# Altium schematic sheet Main Board.SchDoc: Main Board
size Letter
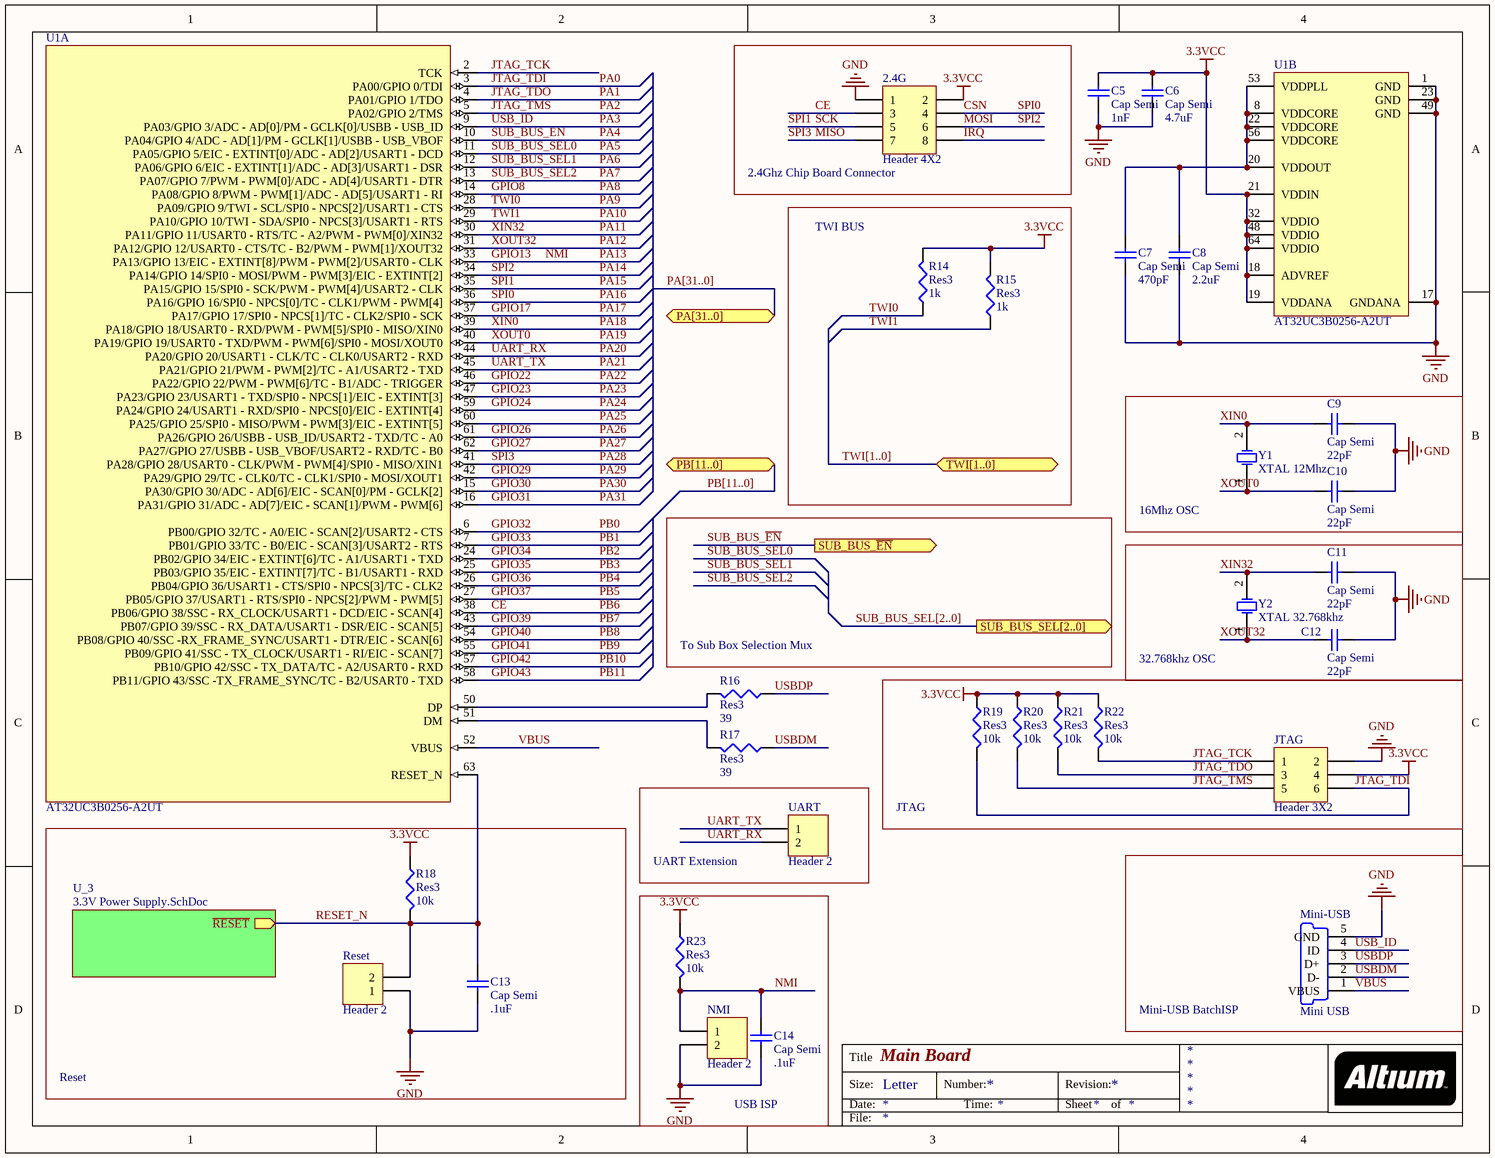
[diagram p0: Main Board.SchDoc]

## Parts
2.4G  Header 4X2  [HDR2X4]
C5  Cap Semi  value 1nF  [CAPC2012N]
C6  Cap Semi  value 4.7uF  [CAPC2012N]
C7  Cap Semi  value 470pF  [CAPC2012N]
C8  Cap Semi  value 2.2uF  [CAPC2012N]
C9  Cap Semi  value 22pF  [CAPC2012N]
C10  Cap Semi  value 22pF  [CAPC2012N]
C11  Cap Semi  value 22pF  [CAPC2012N]
C12  Cap Semi  value 22pF  [CAPC2012N]
C13  Cap Semi  value .1uF  [CAPC2012N]
C14  Cap Semi  value .1uF  [CAPC2012N]
JTAG  Header 3X2  [HDR2X3]
Mini-USB  Mini USB  [MINI USB]
NMI  Header 2  [HDR1X2]
R14  Res3  value 1k  [RESC2012N]
R15  Res3  value 1k  [RESC2012N]
R16  Res3  value 39  [RESC2012N]
R17  Res3  value 39  [RESC2012N]
R18  Res3  value 10k  [RESC2012N]
R19  Res3  value 10k  [RESC2012N]
R20  Res3  value 10k  [RESC2012N]
R21  Res3  value 10k  [RESC2012N]
R22  Res3  value 10k  [RESC2012N]
R23  Res3  value 10k  [RESC2012N]
Reset  Header 2  [HDR1X2]
U1  AT32UC3B0256-A2UT  [TQFP64_N - ECESHOP]  (parts A,B of 2)
UART  Header 2  [HDR1X2]
Y1  XTAL 12Mhz  [HC-49U - Through Hole]
Y2  XTAL 32.768khz  [XTAL32.768]

## Blocks framed on the sheet
2.4Ghz Chip Board Connector: 2.4G
TWI BUS: R14 R15
16Mhz OSC: C9 C10 Y1
32.768khz OSC: C11 C12 Y2
JTAG: JTAG R19-R22
UART Extension: UART
Reset: C13 R18 Reset
Mini-USB BatchISP: Mini-USB
USB ISP: C14 NMI R23

## Sub-sheets
U_3 = 3.3V Power Supply.SchDoc: ~{RESET} (out)

## Ports
PA[31..0] (bidir), PB[11..0] (bidir), SUB_BUS_SEL[2..0] (out), SUB_BUS_~{EN} (out), TWI[1..0] (bidir)

## Nets
3.3VCC: 2.4G.2 C5.2 C6.2 JTAG.4 R14.2 R15.2 R18.1 R19.1 R20.1 R21.1 R22.1 R23.1 U1.18(ADVREF) U1.19(VDDANA) U1.21(VDDIN) U1.32(VDDIO) U1.48(VDDIO) U1.64(VDDIO)
GND: 2.4G.1 C5.1 C6.1 C7.1 C8.1 C9.1 C10.1 C11.1 C12.1 C13.2 C14.2 JTAG.2 Mini-USB.5(GND) NMI.2 Reset.1 U1.1(GND) U1.17(GNDANA) U1.23(GND) U1.49(GND)
CE: 2.4G.3 U1.38(PB06/GPIO_38/SSC_-_RX_CLOCK/USART1_-_DCD/EIC_-_SCAN[4])  [also labelled PB6]
CSN: 2.4G.4 U1.36(PA16/GPIO_16/SPI0_-_NPCS[0]/TC_-_CLK1/PWM_-_PWM[4])  [also labelled PA16, SPI0]
GPIO8: U1.14(PA08/GPIO_8/PWM_-_PWM[1]/ADC_-_AD[5]/USART1_-_RI)  [also labelled PA8]
GPIO13: C14.1 NMI.1 R23.2 U1.33(PA13/GPIO_13/EIC_-_EXTINT[8]/PWM_-_PWM[2]/USART0_-_CLK)  [also labelled NMI, PA13]
GPIO17: U1.37(PA17/GPIO_17/SPI0_-_NPCS[1]/TC_-_CLK2/SPI0_-_SCK)  [also labelled PA17]
GPIO22: U1.46(PA22/GPIO_22/PWM_-_PWM[6]/TC_-_B1/ADC_-_TRIGGER)  [also labelled PA22]
GPIO23: U1.47(PA23/GPIO_23/USART1_-_TXD/SPI0_-_NPCS[1]/EIC_-_EXTINT[3])  [also labelled PA23]
GPIO24: U1.59(PA24/GPIO_24/USART1_-_RXD/SPI0_-_NPCS[0]/EIC_-_EXTINT[4])  [also labelled PA24]
GPIO26: U1.61(PA26/GPIO_26/USBB_-_USB_ID/USART2_-_TXD/TC_-_A0)  [also labelled PA26]
GPIO27: U1.62(PA27/GPIO_27/USBB_-_USB_VBOF/USART2_-_RXD/TC_-_B0)  [also labelled PA27]
GPIO29: U1.42(PA29/GPIO_29/TC_-_CLK0/TC_-_CLK1/SPI0_-_MOSI/XOUT1)  [also labelled PA29]
GPIO30: U1.15(PA30/GPIO_30/ADC_-_AD[6]/EIC_-_SCAN[0]/PM_-_GCLK[2])  [also labelled PA30]
GPIO31: U1.16(PA31/GPIO_31/ADC_-_AD[7]/EIC_-_SCAN[1]/PWM_-_PWM[6])  [also labelled PA31]
GPIO32: U1.6(PB00/GPIO_32/TC_-_A0/EIC_-_SCAN[2]/USART2_-_CTS)  [also labelled PB0]
GPIO33: U1.7(PB01/GPIO_33/TC_-_B0/EIC_-_SCAN[3]/USART2_-_RTS)  [also labelled PB1]
GPIO34: U1.24(PB02/GPIO_34/EIC_-_EXTINT[6]/TC_-_A1/USART1_-_TXD)  [also labelled PB2]
GPIO35: U1.25(PB03/GPIO_35/EIC_-_EXTINT[7]/TC_-_B1/USART1_-_RXD)  [also labelled PB3]
GPIO36: U1.26(PB04/GPIO_36/USART1_-_CTS/SPI0_-_NPCS[3]/TC_-_CLK2)  [also labelled PB4]
GPIO37: U1.27(PB05/GPIO_37/USART1_-_RTS/SPI0_-_NPCS[2]/PWM_-_PWM[5])  [also labelled PB5]
GPIO39: U1.43(PB07/GPIO_39/SSC_-_RX_DATA/USART1_-_DSR/EIC_-_SCAN[5])  [also labelled PB7]
GPIO40: U1.54(PB08/GPIO_40/SSC_-RX_FRAME_SYNC/USART1_-_DTR/EIC_-_SCAN[6])  [also labelled PB8]
GPIO41: U1.55(PB09/GPIO_41/SSC_-_TX_CLOCK/USART1_-_RI/EIC_-_SCAN[7])  [also labelled PB9]
GPIO42: U1.57(PB10/GPIO_42/SSC_-_TX_DATA/TC_-_A2/USART0_-_RXD)  [also labelled PB10]
GPIO43: U1.58(PB11/GPIO_43/SSC_-TX_FRAME_SYNC/TC_-_B2/USART0_-_TXD)  [also labelled PB11]
IRQ: 2.4G.8
JTAG_TCK: JTAG.1 R22.2 U1.2(TCK)
JTAG_TDI: JTAG.6 R19.2 U1.3(PA00/GPIO_0/TDI)  [also labelled PA0]
JTAG_TDO: JTAG.3 R21.2 U1.4(PA01/GPIO_1/TDO)  [also labelled PA1]
JTAG_TMS: JTAG.5 R20.2 U1.5(PA02/GPIO_2/TMS)  [also labelled PA2]
MISO: 2.4G.7 U1.41(PA28/GPIO_28/USART0_-_CLK/PWM_-_PWM[4]/SPI0_-_MISO/XIN1)  [also labelled PA28, SPI3]
MOSI: 2.4G.6 U1.34(PA14/GPIO_14/SPI0_-_MOSI/PWM_-_PWM[3]/EIC_-_EXTINT[2])  [also labelled PA14, SPI2]
PA3: Mini-USB.4(ID) U1.9(PA03/GPIO_3/ADC_-_AD[0]/PM_-_GCLK[0]/USBB_-_USB_ID)  [also labelled USB_ID]
PA4: U1.10(PA04/GPIO_4/ADC_-_AD[1]/PM_-_GCLK[1]/USBB_-_USB_VBOF) ; port SUB_BUS_~{EN}  [also labelled SUB_BUS_~{EN}]
PA5: U1.11(PA05/GPIO_5/EIC_-_EXTINT[0]/ADC_-_AD[2]/USART1_-_DCD)  [also labelled SUB_BUS_SEL0]
PA6: U1.12(PA06/GPIO_6/EIC_-_EXTINT[1]/ADC_-_AD[3]/USART1_-_DSR)  [also labelled SUB_BUS_SEL1]
PA7: U1.13(PA07/GPIO_7/PWM_-_PWM[0]/ADC_-_AD[4]/USART1_-_DTR)  [also labelled SUB_BUS_SEL2]
PA9: R14.1 U1.28(PA09/GPIO_9/TWI_-_SCL/SPI0_-_NPCS[2]/USART1_-_CTS)  [also labelled TWI0]
PA10: R15.1 U1.29(PA10/GPIO_10/TWI_-_SDA/SPI0_-_NPCS[3]/USART1_-_RTS)  [also labelled TWI1]
PA11: C11.2 U1.30(PA11/GPIO_11/USART0_-_RTS/TC_-_A2/PWM_-_PWM[0]/XIN32) Y2.2(OSC2)  [also labelled XIN32]
PA12: C12.2 U1.31(PA12/GPIO_12/USART0_-_CTS/TC_-_B2/PWM_-_PWM[1]/XOUT32) Y2.1(OSC1)  [also labelled XOUT32]
PA15: 2.4G.5 U1.35(PA15/GPIO_15/SPI0_-_SCK/PWM_-_PWM[4]/USART2_-_CLK)  [also labelled SCK, SPI1]
PA18: C9.2 U1.39(PA18/GPIO_18/USART0_-_RXD/PWM_-_PWM[5]/SPI0_-_MISO/XIN0) Y1.2(OSC2)  [also labelled XIN0]
PA19: C10.2 U1.40(PA19/GPIO_19/USART0_-_TXD/PWM_-_PWM[6]/SPI0_-_MOSI/XOUT0) Y1.1(OSC1)  [also labelled XOUT0]
PA20: U1.44(PA20/GPIO_20/USART1_-_CLK/TC_-_CLK0/USART2_-_RXD) UART.2  [also labelled UART_RX]
PA21: U1.45(PA21/GPIO_21/PWM_-_PWM[2]/TC_-_A1/USART2_-_TXD) UART.1  [also labelled UART_TX]
PA25: U1.60(PA25/GPIO_25/SPI0_-_MISO/PWM_-_PWM[3]/EIC_-_EXTINT[5])
RESET_N: C13.1 R18.2 Reset.2 U1.63(RESET_N) ; sheet U_3/~{RESET}
USBDM: Mini-USB.2(D-) R17.1
USBDP: Mini-USB.3(D+) R16.1
VBUS: Mini-USB.1(VBUS) U1.52(VBUS)
NetC7_2: C7.2 C8.2 U1.8(VDDCORE) U1.20(VDDOUT) U1.22(VDDCORE) U1.53(VDDPLL) U1.56(VDDCORE)
NetR16_2: R16.2 U1.50(DP)
NetR17_2: R17.2 U1.51(DM)

## Buses and harness runs
bus PA[31..0] = port PA[31..0]
bus PB[11..0] = port PB[11..0]
bus SUB_BUS_SEL[2..0] = port SUB_BUS_SEL[2..0]
bus TWI[1..0] = port TWI[1..0]

## Notes on the sheet
- (near R16) To Sub Box Selection Mux
- Title
- Size:
- Date:
- Letter
- Number:
- Time:
- Revision:
- Sheet
- of
- File:

## Library data of the parts
2.4G = Header 4X2: Header, 4-Pin, Dual row; LatestRevisionDate: 17-Jul-2002; LatestRevisionNote: Re-released for DXP Platform.; Publisher: Altium Limited
C5-C14 = Cap Semi: Capacitor (Semiconductor SIM Model); Published: 8-Jun-2000; LatestRevisionDate: 29-May-2009; LatestRevisionNote: IPC-7351 Footprint Added.; PackageReference: C1206; Publisher: Altium Limited; PackageDescription: Chip Capacitor
JTAG = Header 3X2: Header, 3-Pin, Dual row; LatestRevisionDate: 17-Jul-2002; LatestRevisionNote: Re-released for DXP Platform.; Publisher: Altium Limited
NMI Reset UART = Header 2: Header, 2-Pin; LatestRevisionDate: 17-Jul-2002; LatestRevisionNote: Re-released for DXP Platform.; Publisher: Altium Limited
R14-R23 = Res3: Resistor; Published: 8-Jun-2000; LatestRevisionDate: 29-May-2009; LatestRevisionNote: IPC-7351 Footprint Added.; PackageReference: J1-0603; Publisher: Altium Limited; PackageDescription: Chip Resistor
U1 = AT32UC3B0256-A2UT: 32-bit AVR UC3 B Series Microcontroller, 256KB Flash, 32KB SRAM, 44 GPIO pins, Industrial Grade, 64-Pin TQFP, Tray; Published: 1-Apr-2010; DatasheetVersion: revH, Feb-2010; PackageVersion: 2010; PackageReference: TQFP64; Publisher: Altium Limited; PackageDescription: 64-Pin Thin Quad Flat Pack, 10 x 10 x 1.0 mm Body, 0.5 mm Pitch; Supplier 1: Digi-Key; Supplier Part Number 1: AT32UC3B0256-A2UT-ND; Supplier 2: Farnell; Supplier Part Number 2: 1715453; Supplier 3: Mouser; Supplier Part Number 3: 556-AT32UC3B0256A2UT; Code_JEDEC: MS-026; ComponentLink1Description: Manufacturer Link; ComponentLink1URL: http://www.atmel.com/products/avr/default.asp?; ComponentLink2Description: AT32UC3B Datasheet; ComponentLink2URL: http://www.atmel.com/dyn/resources/prod_documents/doc32059.pdf; ComponentLink3Description: AT32UC3B Summary; ComponentLink3URL: http://www.atmel.com/dyn/resources/prod_documents/32059S.pdf; ComponentLink4Description: Atmel.com Home; ComponentLink4URL: http://www.atmel.com
Y1 Y2 = XTAL: Crystal Oscillator; Published: 8-Jun-2000; LatestRevisionDate: 17-Jul-2002; LatestRevisionNote: Re-released for DXP Platform.; PackageReference: R38; Publisher: Altium Limited; PackageDescription: Crystal, Thru-Hole; 2 Leads; Body 3.1 x 8.2 mm (Dia.xH)
Mini-USB = Mini USB: Supplier 1: Digi-Key; Supplier Part Number 1: A31727CT-ND